# EAGLE design untitled_revisi (EAGLE 9.6.2)
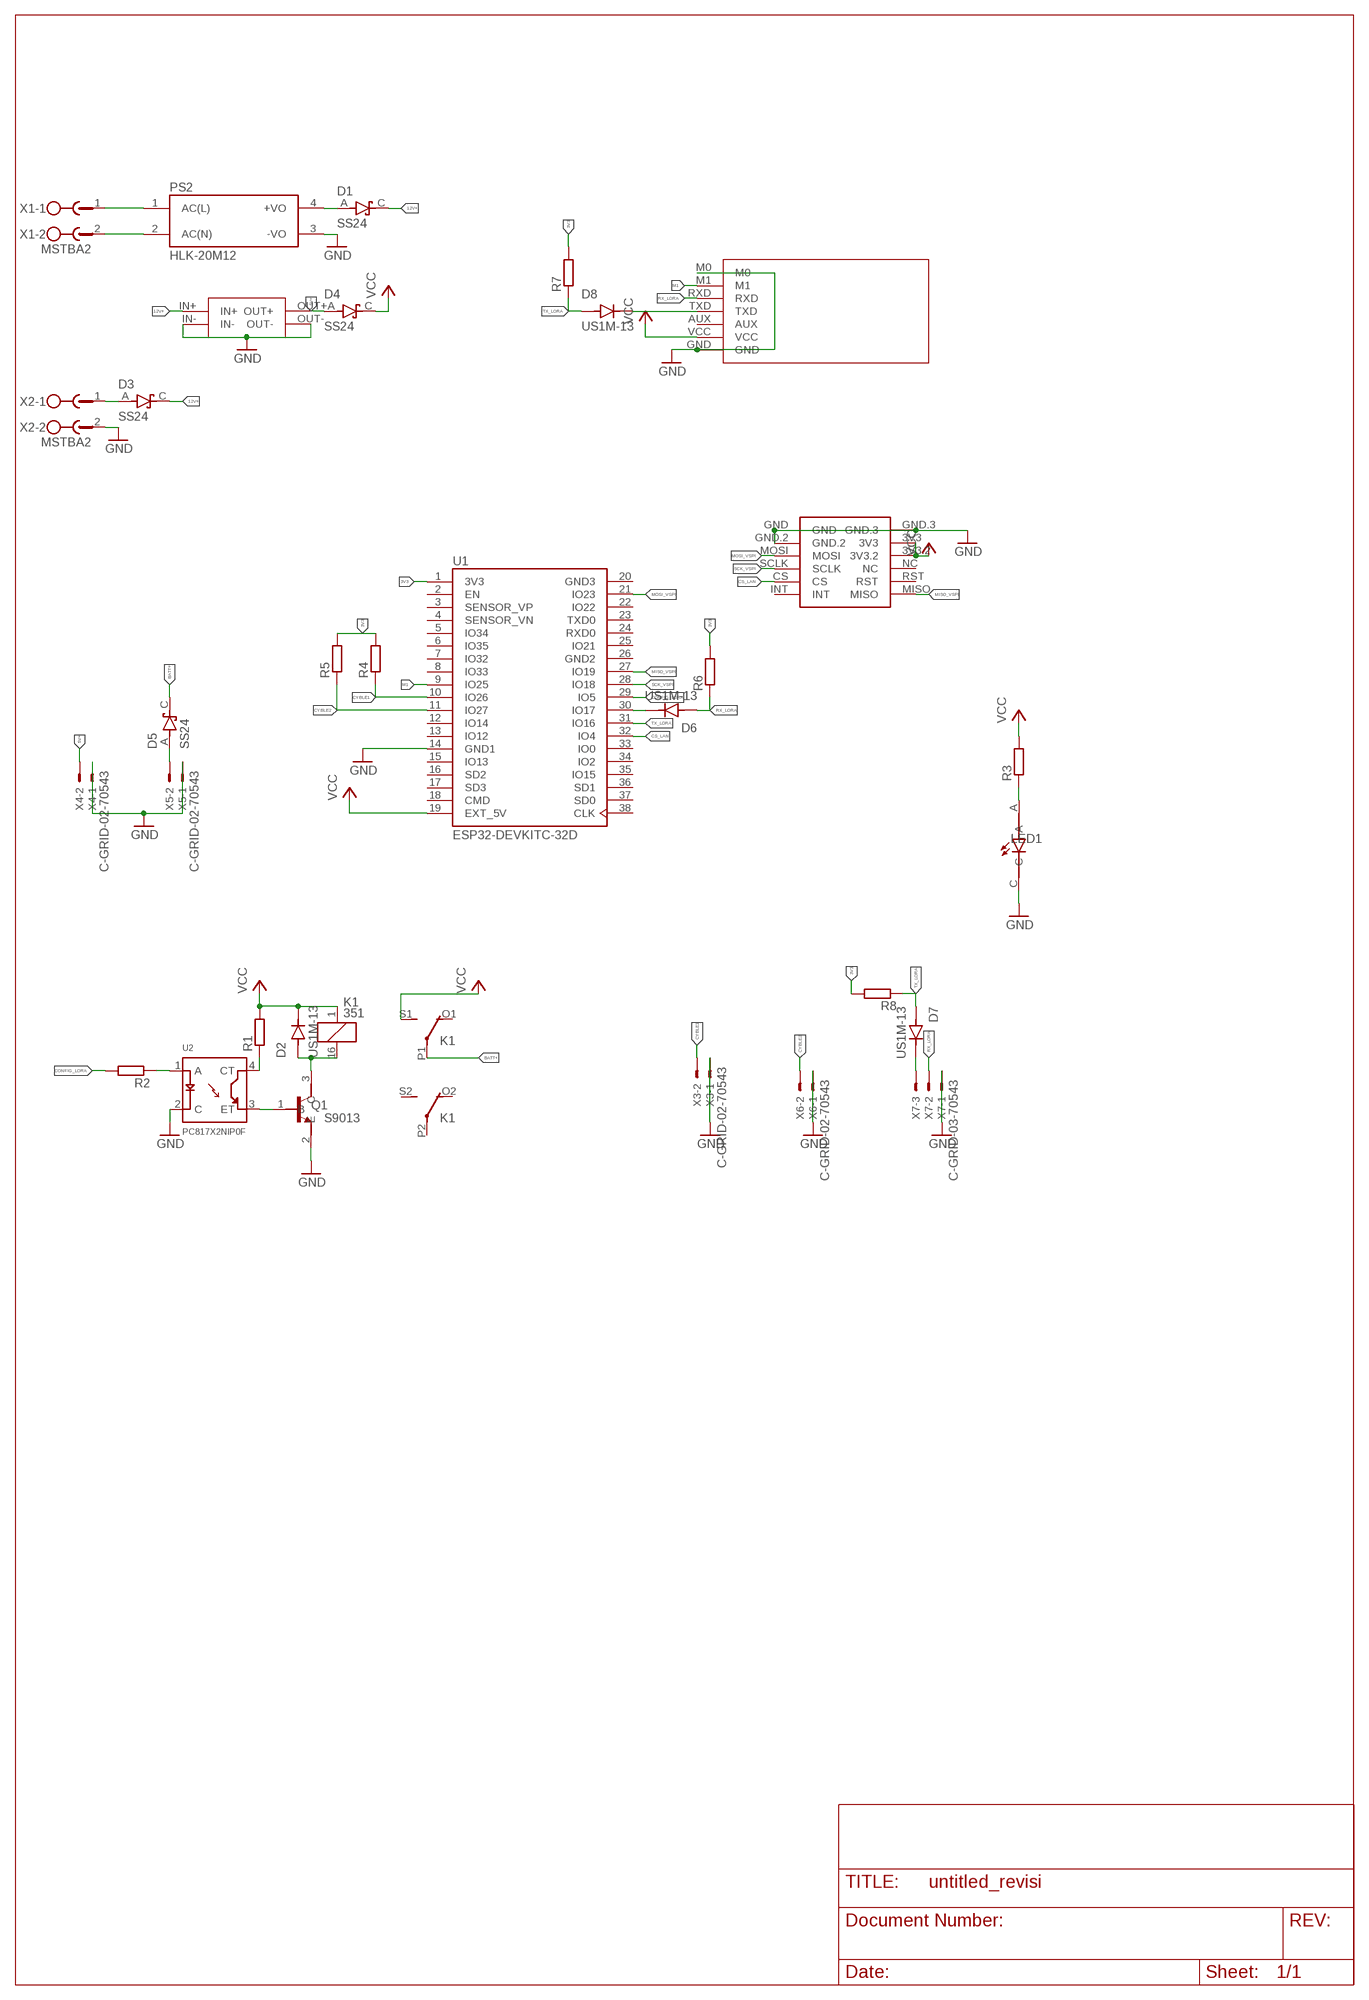
[diagram p0: schematic, sheet 1]

## Parts
D1  SS24  [DIOM5336X265N]
D2  US1M-13  [DIOM5226X240N]
D3  SS24  [DIOM5336X265N]
D4  SS24  [DIOM5336X265N]
D5  SS24  [DIOM5336X265N]
D6  US1M-13  [DIOM5226X240N]
D7  US1M-13  [DIOM5226X240N]
D8  US1M-13  [DIOM5226X240N]
EBYTEE220-900T22D1  EBYTEE220-900T22D  [EBYTEE220-900T22D]
K1  351  [351]
LED1  SML-LXT0805IW-TR  [LEDC2012X120N]
MINI1  MINI560  [MINI560]
PS2  HLK-20M12  [CONV_HLK-20M12]
Q1  S9013  [SOT95P240X120-3N]
R1  R-EU_R0805  [R0805]
R2  R-EU_R0805  [R0805]
R3  R-EU_R0805  [R0805]
R4  R-EU_R0805  [R0805]
R5  R-EU_R0805  [R0805]
R6  R-EU_R0805  [R0805]
R7  R-EU_R0805  [R0805]
R8  R-EU_R0805  [R0805]
U1  ESP32-DEVKITC-32D  [MODULE_ESP32-DEVKITC-32D]
U2  PC817X2NIP0F  [SOT254P975X400-4N]
U$1  MINI_W5500  [MINI_W5500]
X1  MSTBA2  [MSTBA2]
X2  MSTBA2  [MSTBA2]
X3  C-GRID-02-70543  [70543-02]
X4  C-GRID-02-70543  [70543-02]
X5  C-GRID-02-70543  [70543-02]
X6  C-GRID-02-70543  [70543-02]
X7  C-GRID-03-70543  [70543-03]

## Nets
3V3: R4.2 R5.2 R6.2 R7.2 R8.2 U1.1(3V3)
5V+: D4.A MINI1.OUT+ X4.2
12V+: D1.C(K) D3.C(K) MINI1.IN+
BATT+: D5.C(K) K1.P1(2:P)
CONFIG_LORA: R2.2 U1.29(IO5)
CS_LAN: U1.32(IO4) U$1.CS
CYBLE1: R4.1 U1.10(IO26) X3.2
CYBLE2: R5.1 U1.11(IO27) X6.2
GND: EBYTEE220-900T22D1.GND EBYTEE220-900T22D1.M0 LED1.C MINI1.IN- MINI1.OUT- PS2.3(-VO) Q1.2(E) U1.14(GND1) U2.2(C) U$1.GND U$1.GND.2 U$1.GND.3 X2.2 X3.1 X4.1 X5.1 X6.1 X7.1
M1: EBYTEE220-900T22D1.M1 U1.9(IO25)
MISO_VSPI: U1.27(IO19) U$1.MISO
MOSI_VSPI: U1.21(IO23) U$1.MOSI
N$1: PS2.1(AC(L)) X1.1
N$2: PS2.2(AC(N)) X1.2
N$3: D1.A PS2.4(+VO)
N$4: R2.1 U2.1(A)
N$5: D3.A X2.1
N$6: D2.A K1.16 Q1.3(C)
N$7: Q1.1(B) U2.3(ET)
N$8: R1.1 U2.4(CT)
N$9: D6.C(K) U1.30(IO17)
N$10: LED1.A R3.1
N$11: D8.C(K) EBYTEE220-900T22D1.TXD
N$12: D5.A X5.2
N$13: D7.C(K) X7.3
RX_LORA: D6.A EBYTEE220-900T22D1.RXD R6.1 X7.2
SCK_VSPI: U1.28(IO18) U$1.SCLK
TX_LORA: D7.A D8.A R7.1 R8.1 U1.31(IO16)
VCC: D2.C(K) D4.C(K) EBYTEE220-900T22D1.VCC K1.1 K1.S1(2:S) R1.2 R3.2 U1.19(EXT_5V) U$1.3V3 U$1.3V3.2
Unconnected: EBYTEE220-900T22D1.AUX K1.O1(2:O) K1.O2(3:O) K1.P2(3:P) K1.S2(3:S) U1.2(EN) U1.3(SENSOR_VP) U1.4(SENSOR_VN) U1.5(IO34) U1.6(IO35) U1.7(IO32) U1.8(IO33) U1.12(IO14) U1.13(IO12) U1.15(IO13) U1.16(SD2) U1.17(SD3) U1.18(CMD) U1.22(IO22) U1.23(TXD0) U1.24(RXD0) U1.25(IO21) U1.33(IO0) U1.34(IO2) U1.35(IO15) U1.36(SD1) U1.37(SD0) U1.38(CLK) U$1.INT U$1.NC U$1.RST

## Power pins joined to a net without a drawn wire
GND2: U1.26(GND2)
GND3: U1.20(GND3)

## Library data of the parts
D1 D3-D5 = SS24:SS24: Diode Schottky 40V 2A Surface Mount DO-214AA (SMB) Check availability <https://pricing.snapeda.com/parts/SS24/ON%20Semiconductor/view-part?ref=eda>; AVAILABILITY: In Stock; CHECK_PRICES: https://www.snapeda.com/parts/SS24/Onsemi/view-part/?ref=eda; DESCRIPTION: Diode Schottky 40V 2A Surface Mount DO-214AA (SMB); MF: ON Semiconductor; MP: SS24; PACKAGE: DO-214AA ON Semiconductor; PRICE: None; SNAPEDA_LINK: https://www.snapeda.com/parts/SS24/Onsemi/view-part/?ref=snap
D2 D6-D8 = US1M-13:US1M-13: Diode, Fast Recovery, 1a, 1kv, Do-214ac-2, Full Reel Check availability <https://pricing.snapeda.com/parts/US1M-13/Diodes%20Incorporated/view-part?ref=eda>; AVAILABILITY: In Stock; DESCRIPTION: Diode Standard 1000 V 1A Surface Mount SMA; MF: Diodes Incorporated; MP: US1M-13; PACKAGE: DO-214AC-214 Diodes Incorporated; PRICE: None; PURCHASE-URL: https://pricing.snapeda.com/search/part/US1M-13/?ref=eda
EBYTEE220-900T22D1 = EByte E220-900T22D:EBYTEE220-900T22D
K1 = relay:351: RELAY 2 x switch, Omron; OC_FARNELL: unknown; OC_NEWARK: unknown
LED1 = SML-LXT0805IW-TR:SML-LXT0805IW-TR: LED; Luminous Intensity:11µcd; Viewing Angle:140°; Forward Current:30mA; Forward Voltage:2V; Color:Red; LED Color:Red; Leaded Process Compatible:Yes; Lens Color:White; Mounting Type:Surface Mount ;RoHS Compliant: Yes Check availability <https://pricing.snapeda.com/parts/SML-LXT0805IW-TR/Lumex%20Opto/Components/view-part?ref=eda>; AVAILABILITY: In Stock; DESCRIPTION: Red - LED Indication - Discrete 2V 0805 (2012 Metric); MF: Lumex Opto/Components; MP: SML-LXT0805IW-TR; PACKAGE: 0805 Lumex; PRICE: None; PURCHASE-URL: https://pricing.snapeda.com/search/part/SML-LXT0805IW-TR/?ref=eda
MINI1 = MINI560:MINI560
PS2 = HLK-20M12:HLK-20M12: Check availability <https://pricing.snapeda.com/parts/HLK-20M12/Hi-link/view-part?ref=eda>; AVAILABILITY: Not in stock; CHECK_PRICES: https://www.snapeda.com/parts/HLK-20M12/Hi-link/view-part/?ref=eda; DESCRIPTION: 20W ultra-small series module power supply; MF: Hi-link; MP: HLK-20M12; PACKAGE: Non-Standard Hi-link; PRICE: None; SNAPEDA_LINK: https://www.snapeda.com/parts/HLK-20M12/Hi-link/view-part/?ref=snap
Q1 = S9013:S9013: SMD Transistors NPN 25V-500mA Check availability <https://pricing.snapeda.com/parts/S9013/JCET/view-part?ref=eda>; AVAILABILITY: In Stock; DESCRIPTION: Bipolar (BJT) Transistor NPN 20V 500mA 625mW Through Hole TO-92-3; MF: JCET; MP: S9013; PACKAGE: SOT-23-3 JCET; PRICE: None; PURCHASE-URL: https://pricing.snapeda.com/search/part/S9013/?ref=eda
R1-R8 = rcl:R-EU_: RESISTOR, European symbol; SPICEPREFIX: R
U1 = ESP32-DEVKITC-32D:ESP32-DEVKITC-32D: Eval Board For Esp-Wroom-32 Check availability <https://pricing.snapeda.com/parts/ESP32-DEVKITC-32D/Espressif%20Systems/view-part?ref=eda>; AVAILABILITY: In Stock; DESCRIPTION: WiFi Development Tools (802.11) ESP32 General Development Kit, ESP32-WROOM-32D on the board; MF: Espressif Systems; MP: ESP32-DEVKITC-32D; PACKAGE: None; PRICE: None; PURCHASE-URL: https://pricing.snapeda.com/search/part/ESP32-DEVKITC-32D/?ref=eda
U2 = PC817X2NIP0F:PC817X2NIP0F: PC817 Series 1 Channel 80 V 5000 Vrms General Purpose Photocoupler - DIP-4 Check availability <https://pricing.snapeda.com/parts/PC817X2NIP0F/Sharp%20Microelectronics/view-part?ref=eda>; AVAILABILITY: Not in stock; DESCRIPTION: Optoisolator Transistor Output 5000Vrms 1 Channel 4-SMD; MF: Sharp Microelectronics; MP: PC817X2NIP0F; PACKAGE: SMD-4 Sharp Microelectronics; PRICE: None
U$1 = ethernet-mikroavr:MINI_W5500: MINI ETHERNET W5500, CREATE BY MIKROAVR.COM
X1 X2 = con-phoenix-508:MSTBA2: PHOENIX; MF: FARNELL; MPN: 1757242; OC_FARNELL: 3705171; OC_NEWARK: 71C4161
X3-X6 = con-molex:C-GRID-02: CONNECTOR wire to board 2.54 mm (0.100") pitch header; MF: MOLEX; OC_FARNELL: unknown; OC_NEWARK: unknown
X7 = con-molex:C-GRID-03: CONNECTOR wire to board 2.54 mm (0.100") pitch header; MF: MOLEX; OC_FARNELL: unknown; OC_NEWARK: unknown

## Board
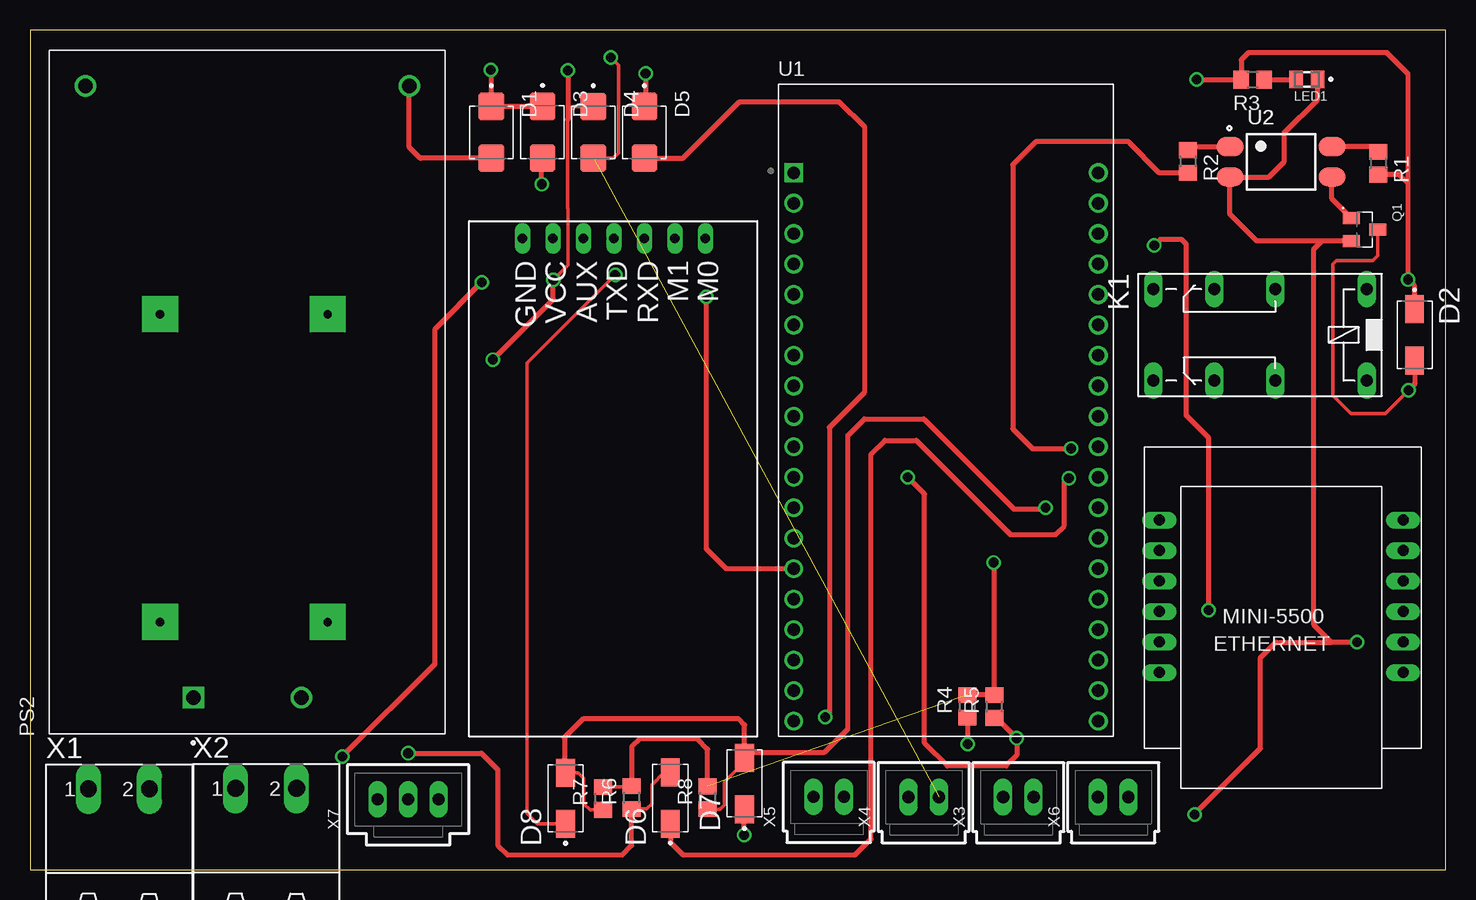
[diagram p1: board, top side]
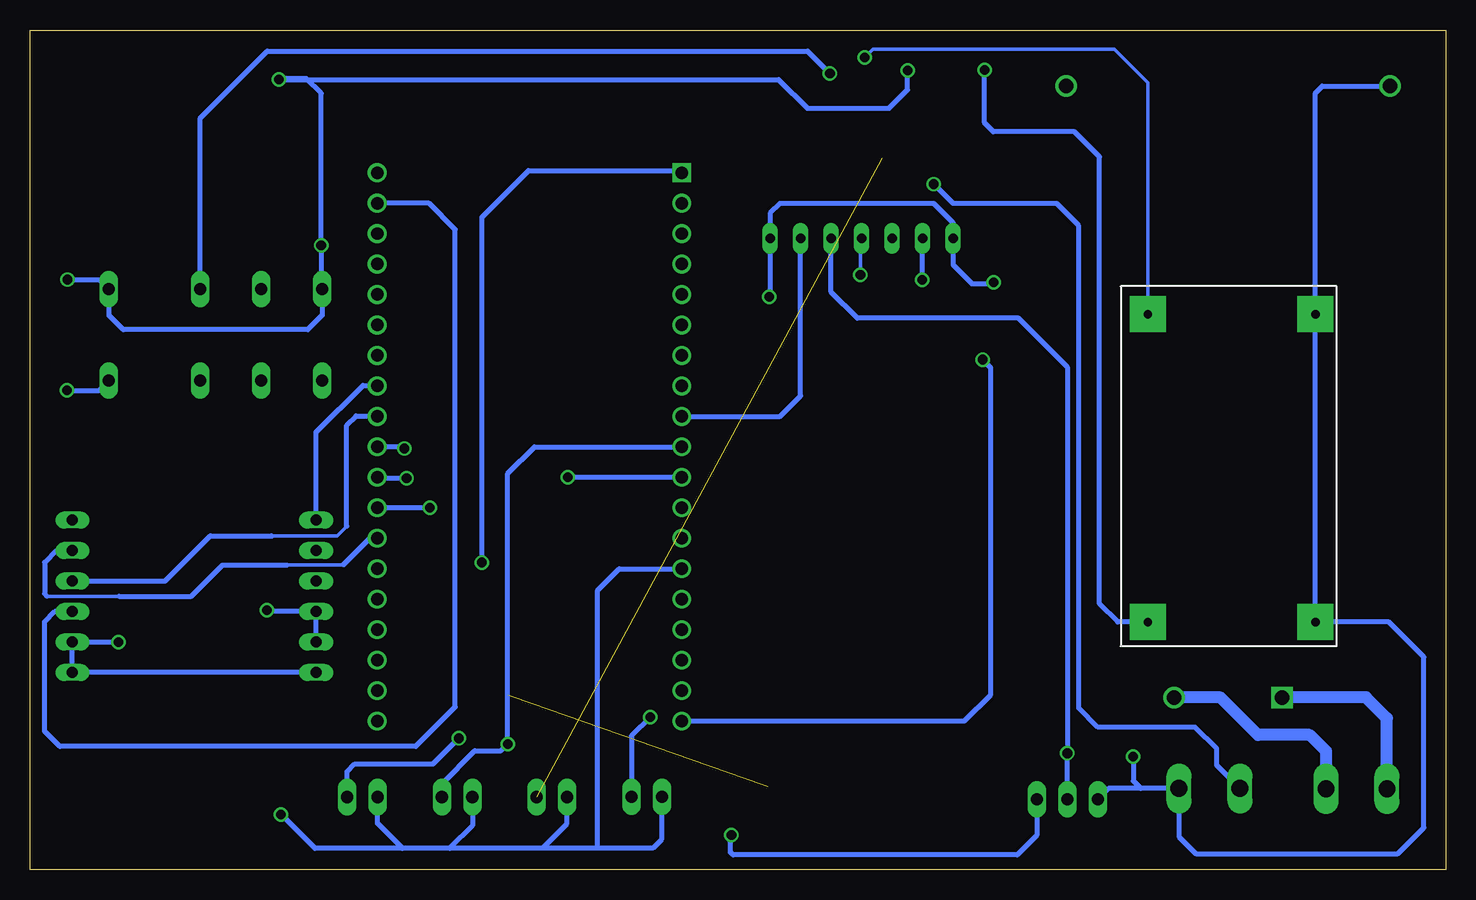
[diagram p2: board, bottom side, seen from below]

Size 118 x 70 mm. Coordinates in mm from the lower left corner, seen from the top.
Outline: 0,0 118,0 118,70 0,70 0,0
Copper layers (1*16): Top 0.035mm / dielectric 1.5mm / Bottom 0.035mm
Design rules "default": minimum track width 6mil, minimum drill 0.35mm, track to track 6mil, track to pad 6mil, pad to pad 6mil, via to via 6mil, smd to smd 6mil, copper to edge 40mil, drill to drill 6mil, minimum pad ring 10mil, minimum via ring 8mil, stop-mask expansion 4mil, vias tented up to drill 0mil, thermal gap 10mil

### Footprints (pad centres in the part's own frame; a part is rotated, then mirrored left to right if it is on the bottom)
DIOM5336X265N = smd 2.29 x 2.12: A 2.16,0; C -2.16,0
DIOM5226X240N = smd 2.33 x 1.55: A 2.135,0; C -2.135,0
EBYTEE220-900T22D = drill 0.8 pad 1.27 long: AUX -4.56,-10.98; GND -4.56,-16.06; M0 -4.56,-0.82; M1 -4.56,-3.36; RXD -4.56,-5.9; TXD -4.56,-8.44; VCC -4.56,-13.52
351 = drill 1.016 long: 1 -3.81,-3.81; 16 -3.81,3.81; O1 8.89,-3.81; O2 8.89,3.81; P1 3.81,-3.81; P2 3.81,3.81; S1 13.97,-3.81; S2 13.97,3.81
LEDC2012X120N = smd 1.1 x 1.45: A 0.9,0; C -0.9,0
MINI560 = drill 0.7 pad 3 square: IN+ 0,-1.27; IN- 0,-15.24; OUT+ 25.67,-1.27; OUT- 25.67,-15.24
CONV_HLK-20M12 = drill 1.2 square: 1 -25.5,4.5 | drill 1.2: 2 -25.5,-4.5; 3 25.5,13.5; 4 25.5,-13.5
SOT95P240X120-3N = smd 1 x 1.4: 1 -0.95,-1.1; 2 0.95,-1.1; 3 0,1.1
R0805 = smd 1.3 x 1.5: 1 -0.95,0; 2 0.95,0
MODULE_ESP32-DEVKITC-32D = drill 1.04 square: 1 -12.7,19.76 | drill 1.04: 2 -12.7,17.22; 3 -12.7,14.68; 4 -12.7,12.14; 5 -12.7,9.6; 6 -12.7,7.06; 7 -12.7,4.52; 8 -12.7,1.98; 9 -12.7,-0.56; 10 -12.7,-3.1; 11 -12.7,-5.64; 12 -12.7,-8.18; 13 -12.7,-10.72; 14 -12.7,-13.26; 15 -12.7,-15.8; 16 -12.7,-18.34; 17 -12.7,-20.88; 18 -12.7,-23.42; 19 -12.7,-25.96; 20 12.7,19.76; 21 12.7,17.22; 22 12.7,14.68; 23 12.7,12.14; 24 12.7,9.6; 25 12.7,7.06; 26 12.7,4.52; 27 12.7,1.98; 28 12.7,-0.56; 29 12.7,-3.1; 30 12.7,-5.64; 31 12.7,-8.18; 32 12.7,-10.72; 33 12.7,-13.26; 34 12.7,-15.8; 35 12.7,-18.34; 36 12.7,-20.88; 37 12.7,-23.42; 38 12.7,-25.96
SOT254P975X400-4N = smd 2.25 x 1.6: 1 -4.25,1.27; 2 -4.25,-1.27; 3 4.25,-1.27; 4 4.25,1.27
MINI_W5500 = drill 0.914 long: 3V3 21.844,-8.89; 3V3.2 21.844,-11.43; CS 1.524,-16.51; GND 1.524,-6.35; GND.2 1.524,-8.89; GND.3 21.844,-6.35; INT 1.524,-19.05; MISO 21.844,-19.05; MOSI 1.524,-11.43; NC 21.844,-13.97; RST 21.844,-16.51; SCLK 1.524,-13.97
MSTBA2 = drill 1.397 long: 1 -2.54,5.08; 2 2.54,5.08
70543-02 = drill 1.016 long: 1 -1.27,0; 2 1.27,0
70543-03 = drill 1.016 long: 1 -2.54,0; 2 0,0; 3 2.54,0

### Placement (x,y rotation side)
D1  38.46,61.46 270 top
D2  115.42,44.59 270 top
D3  42.73,61.47 270 top
D4  46.96,61.46 270 top
D5  51.21,61.47 270 top
D6  53.38,5.96 90 top
D7  59.57,7.17 90 top
D8  44.65,5.94 90 top
EBYTEE220-900T22D1  57.12,48.06 270 top
K1  107.61,44.58 180 top
LED1  106.43,65.89 180 top
MINI1  26.08,20.63 90 bottom
PS2  18.11,39.82 90 top
Q1  111.25,53.36 270 top
R1  112.4,58.88 270 top
R2  96.52,59.03 270 top
R3  101.92,65.83 180 top
R4  78.14,13.6 90 top
R5  80.39,13.59 90 top
R6  50.17,6 90 top
R7  47.76,5.93 90 top
R8  56.5,5.99 90 top
U1  76.36,38.34 0 top
U2  104.29,59 0 top
U$1  115.99,10.09 180 top
X1  7.42,1.64 0 top
X2  19.68,1.68 0 top
X3  82.39,6.04 0 top
X4  74.5,6.05 0 top
X5  66.59,6.07 0 top
X6  90.3,6.05 0 top
X7  31.52,5.86 0 top

### Tracks (layer width: path | path; a pad name or v marks a point on that pad's centre or on a via)
3V3  (via drill 0.8 pad 1.2)  (1 unrouted)
  Top 0.305: R7.2 50.1,6.88 R6.2
  Top 0.406: R4.2 R5.2 80.39,25.54 v80.33,25.6 | R8.2 56.5,10.04 55.63,10.91 50.84,10.91 50.17,10.24 R6.2
  Bottom 0.406: v80.33,25.6 80.33,54.39 76.44,58.27 63.83,58.27 U1.1
5V+  (via drill 0.8 pad 1.2)  (1 unrouted)
  Top 0.305: D4.A 48.6,59.3 49.04,59.74 49.04,67.08 v48.42,67.7
  Bottom 0.305: v48.42,67.7 47.73,68.4 27.59,68.4 24.81,65.62 MINI1.OUT+
12V+  (via drill 0.8 pad 1.2)
  Top 0.406: D3.C D1.C 38.42,63.66 v38.42,66.68
  Bottom 0.406: MINI1.IN+ 27.31,20.63 28.84,22.15 28.84,59.43 30.92,61.51 37.69,61.51 38.44,62.26 38.44,66.62 38.45,66.64 v38.42,66.68
BATT+  (via drill 0.8 pad 1.2)
  Top 0.406: v51.31,66.37 51.31,63.73 D5.C
  Bottom 0.406: K1.P1 103.81,62.65 98.21,68.24 53.18,68.24 v51.31,66.37
CONFIG_LORA  (via drill 0.8 pad 1.2)
  Top 0.406: R2.2 94.17,58.08 91.55,60.69 83.87,60.69 81.93,58.75 81.93,36.73 83.56,35.1 v86.78,35.1
  Bottom 0.406: v86.78,35.1 86.91,35.24 U1.29
CS_LAN
  Bottom 0.305: 116.59,22.79 110.57,22.79 | 96.57,25.38 91.91,25.38 91.89,25.41
  Bottom 0.406: U$1.CS 115.8,26.6 116.78,25.62 116.78,22.98 116.59,22.79 | 110.57,22.79 104.54,22.79 101.95,25.38 96.57,25.38 | 91.89,25.41 89.67,27.62 U1.32
CYBLE1  (via drill 0.8 pad 1.2)
  Top 0.406: v78.18,10.47 78.18,12.61 R4.1
  Bottom 0.406: X3.2 83.66,7.16 80.92,9.9 78.75,9.9 v78.18,10.47 78.18,33.01 75.95,35.24 U1.10
CYBLE2  (via drill 0.8 pad 1.2)
  Top 0.406: R5.1 80.56,12.64 v82.27,10.94 82.27,9.53 81.37,8.64 76.46,8.64 74.58,10.52 74.58,31.3 v73.16,32.72
  Bottom 0.406: X6.2 91.57,8.16 90.93,8.8 84.4,8.8 v82.27,10.94 | v73.16,32.72 63.68,32.72 U1.11
GND  (via drill 0.8 pad 1.2)
  Top 0.406: U2.2 100.16,57.73 | 100.16,57.73 103.26,57.73 104.55,59.02 104.55,61.42 107.33,64.21 LED1.C | Q1.2 107.69,52.41 | 107.69,52.41 102.26,52.41 100.03,54.63 100.03,57.61 100.16,57.73 | v110.63,18.95 108.48,18.95 | 108.48,18.95 107.02,20.41 107.02,51.74 107.69,52.41 | v37.66,48.97 33.73,45.04 33.73,17.12 v26.03,9.42 | v97.07,4.59 102.58,10.1 102.58,17.66 103.87,18.95 108.48,18.95 | U1.14 58.04,25.08 56.39,26.74 v56.39,47.74
  Bottom 0.406: 25.41,6.76 X2.2 22.22,2.73 20.82,1.33 3.96,1.33 1.8,3.49 1.8,17.71 4.72,20.63 MINI1.IN- MINI1.OUT- 10.84,64.75 10.27,65.32 PS2.3 | 25.41,6.76 28.08,6.76 X7.1 | U$1.GND.3 U$1.GND U$1.GND.2 110.65,18.98 v110.63,18.95 | X3.1 81.12,3.65 82.98,1.8 | 82.98,1.8 83.01,1.76 86.94,1.76 | X6.1 89.03,3.85 86.94,1.76 | 86.94,1.76 | 82.98,1.8 75.26,1.8 75.23,1.83 | X4.1 73.23,3.83 75.23,1.83 | 75.23,1.83 70.68,1.83 | 70.68,1.83 66.02,1.83 65.32,2.54 X5.1 | v37.66,48.97 37.69,48.97 37.81,48.85 39.49,48.85 41.06,50.42 EBYTEE220-900T22D1.GND 41.06,53.94 42.65,55.53 55.49,55.53 56.3,54.73 EBYTEE220-900T22D1.M0 56.3,47.83 v56.39,47.74 | v26.03,9.42 26.03,7.38 25.41,6.76 | 86.94,1.76 94.24,1.76 v97.07,4.59 | 70.68,1.83 70.68,23.28 68.88,25.08 U1.14
M1
  Bottom 0.406: U1.9 55.48,37.78 53.76,39.5 EBYTEE220-900T22D1.M1
MISO_VSPI
  Bottom 0.406: U$1.MISO 94.15,36.46 90.24,40.37 89.11,40.37 U1.27
MOSI_VSPI
  Bottom 0.406: U$1.MOSI 115.92,21.52 116.78,20.66 116.78,11.52 115.51,10.25 85.85,10.25 82.56,13.55 82.56,53.37 84.75,55.56 U1.21
N$1
  Bottom 1.016: X1.1 4.88,12.61 6.64,14.37 13.56,14.37 PS2.1
N$2
  Bottom 1.016: X1.2 9.96,9.87 11.32,11.23 15.64,11.23 18.76,14.34 22.59,14.34 PS2.2
N$3
  Top 0.406: D1.A 32.54,59.3 31.61,60.23 PS2.4
N$4
  Top 0.406: R2.1 96.81,60.27 U2.1
N$5  (via drill 0.8 pad 1.2)
  Top 0.406: v42.66,57.15 42.66,59.24 D3.A
  Bottom 0.406: X2.1 19.07,8.7 19.07,10.07 20.88,11.87 28.97,11.87 30.57,13.46 30.57,53.68 32.41,55.53 41.03,55.53 v42.66,57.15
N$6  (via drill 0.8 pad 1.2)
  Top 0.305: Q1.3 112.35,51.18 111.95,50.78 108.88,50.78 108.59,50.49 108.59,39.53 110.11,38.01 112.97,38.01 v114.91,39.96
  Top 0.406: D2.A 115.42,40.46 v114.91,39.96
  Bottom 0.406: v114.91,39.96 112.24,39.96 K1.16
N$7
  Top 0.406: Q1.1 108.54,55.92 U2.3
N$8
  Top 0.406: R1.1 111.96,60.27 U2.4
N$9  (via drill 0.8 pad 1.2)
  Top 0.406: D6.C 53.38,2.28 54.44,1.22 68.77,1.22 70.11,2.56 70.11,34.63 71.25,35.78 73.88,35.78 81.72,27.94 85.5,27.94 86.22,28.66 86.22,32.23 v86.6,32.61
  Bottom 0.406: v86.6,32.61 88.97,32.61 U1.30
N$10
  Top 0.406: R3.1 105.48,65.83 LED1.A
N$11  (via drill 0.8 pad 1.2)
  Top 0.305: D8.C 42.3,3.81 41.43,4.67 41.43,42.24 v48.77,49.58
  Bottom 0.305: v48.77,49.58 48.77,52.53 EBYTEE220-900T22D1.TXD
N$12  (via drill 0.8 pad 1.2)
  Top 0.406: D5.A 54.43,59.31 59.14,64.01 67.45,64.01 69.55,61.92 | 69.55,61.92 69.57,61.9 | 69.55,61.92 69.55,39.78 66.63,36.87 66.63,13.05 v66.29,12.7
  Bottom 0.406: v66.29,12.7 67.86,11.13 X5.2
N$13  (via drill 0.8 pad 1.2)
  Top 0.406: v59.52,2.89 59.52,4.99 D7.C
  Bottom 0.406: X7.3 34.06,2.86 35.7,1.22 59.38,1.22 59.64,1.47 59.64,2.77 v59.52,2.89
RX_LORA  (via drill 0.8 pad 1.2)
  Top 0.305: R6.1 51.4,5.05 51.85,5.49 51.85,7.08 52.86,8.09 D6.A
  Top 0.406: v31.52,9.69 37.64,9.69 38.98,8.34 38.98,2.04 39.8,1.22 49.38,1.22 50.17,2 R6.1
  Bottom 0.406: X7.2 v31.52,9.69 31.52,41.9 35.59,45.97 49.03,45.97 51.22,48.15 EBYTEE220-900T22D1.RXD
SCK_VSPI
  Bottom 0.305: 97.85,27.79 92.41,27.79 91.59,28.61
  Bottom 0.406: U$1.SCLK 106.74,24.06 102.98,27.82 97.87,27.82 97.85,27.79 | 91.59,28.61 91.59,37.06 90.83,37.82 89.1,37.82 U1.28
TX_LORA  (via drill 0.8 pad 1.2)
  Top 0.305: R7.1 46.68,4.98 46.16,5.5 46.16,7.59 45.67,8.08 D8.A | R8.1 57.54,5.04 57.88,5.38 57.88,7.3 59.57,8.99 D7.A
  Top 0.406: D7.A 59.57,9.87 | 59.57,9.87 59.57,12.07 59.1,12.54 46.1,12.54 44.56,11.01 44.56,8.16 D8.A | v84.68,30.16 84.56,30.04 82.04,30.04 74.51,37.57 69.55,37.57 68.17,36.19 68.17,11.73 66.18,9.74 60.37,9.74 60.2,9.91 59.61,9.91 59.57,9.87
  Bottom 0.406: v84.68,30.16 U1.31
VCC  (via drill 0.8 pad 1.2)
  Top 0.305: D4.C 45.29,63.62 44.8,63.13 44.8,62.53 44.8,55.17 44.85,55.11 44.85,50.4 v43.62,49.16
  Top 0.406: D2.C 115.42,48.68 114.91,49.19 v114.89,49.19 114.89,57.17 | 114.89,57.17 114.12,57.94 R1.2 | 114.89,57.17 114.89,66.33 113.11,68.11 101.57,68.11 100.97,67.51 R3.2 100.93,65.87 v97.26,65.87 | v38.6,42.52 43.62,47.53 v43.62,49.16 | v98.25,21.61 98.25,35.99 96.39,37.86 96.39,52.16 96.01,52.53 94.22,52.53 v93.73,52.03 | v44.85,66.62 44.85,62.58 44.8,62.53
  Bottom 0.406: U$1.3V3 U$1.3V3.2 98.16,21.52 v98.25,21.61 | v114.89,49.19 112.22,49.19 K1.1 111.42,46.22 110.22,45.01 94.85,45.01 93.64,46.22 K1.S1 93.73,48.47 v93.73,52.03 93.73,64.71 94.97,65.96 97.26,65.96 v97.26,65.87 55.6,65.87 53.19,63.47 46.39,63.47 44.85,65.01 v44.85,66.62 | U1.19 40.11,12.38 37.91,14.58 37.91,41.83 v38.6,42.52 | v43.62,49.16 43.62,52.61 EBYTEE220-900T22D1.VCC